# Altium schematic sheet Leds Switches.SchDoc: Bluebell Pod
size C; Author: DM; CompanyName: Silver Bullet Technology LLC; DrawnBy: D.McIntire; Engineer: DM; Organization: Silver Bullet Technology; Address1: Schematic; Address2: 5300 Via Andrea; Address3: Newbury Park, CA 91320; Address4: USA; DocumentNumber: BLUEBELL-POD; SheetNumber: 5; SheetTotal: 11
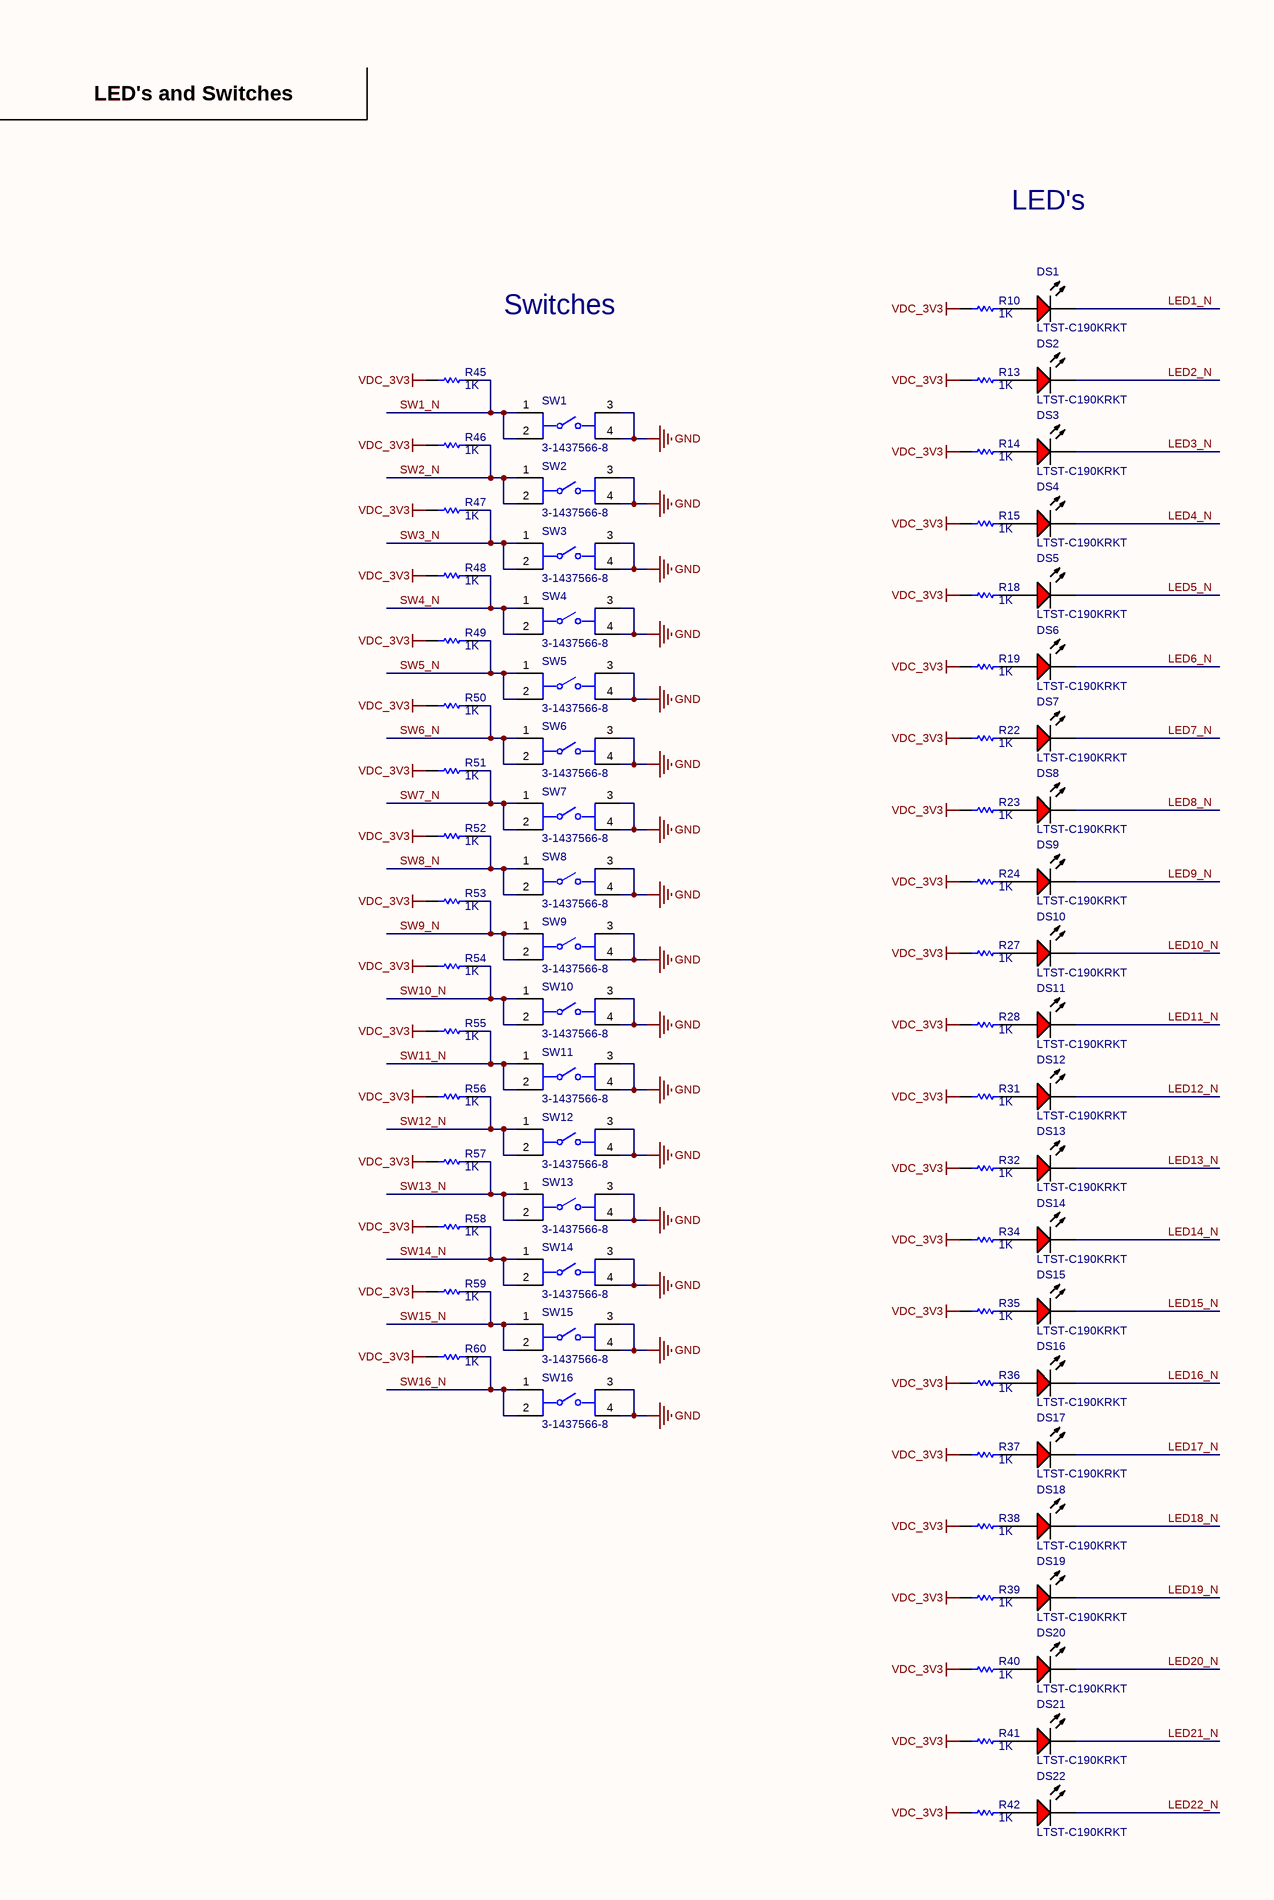
[diagram p0: Leds Switches.SchDoc, left]
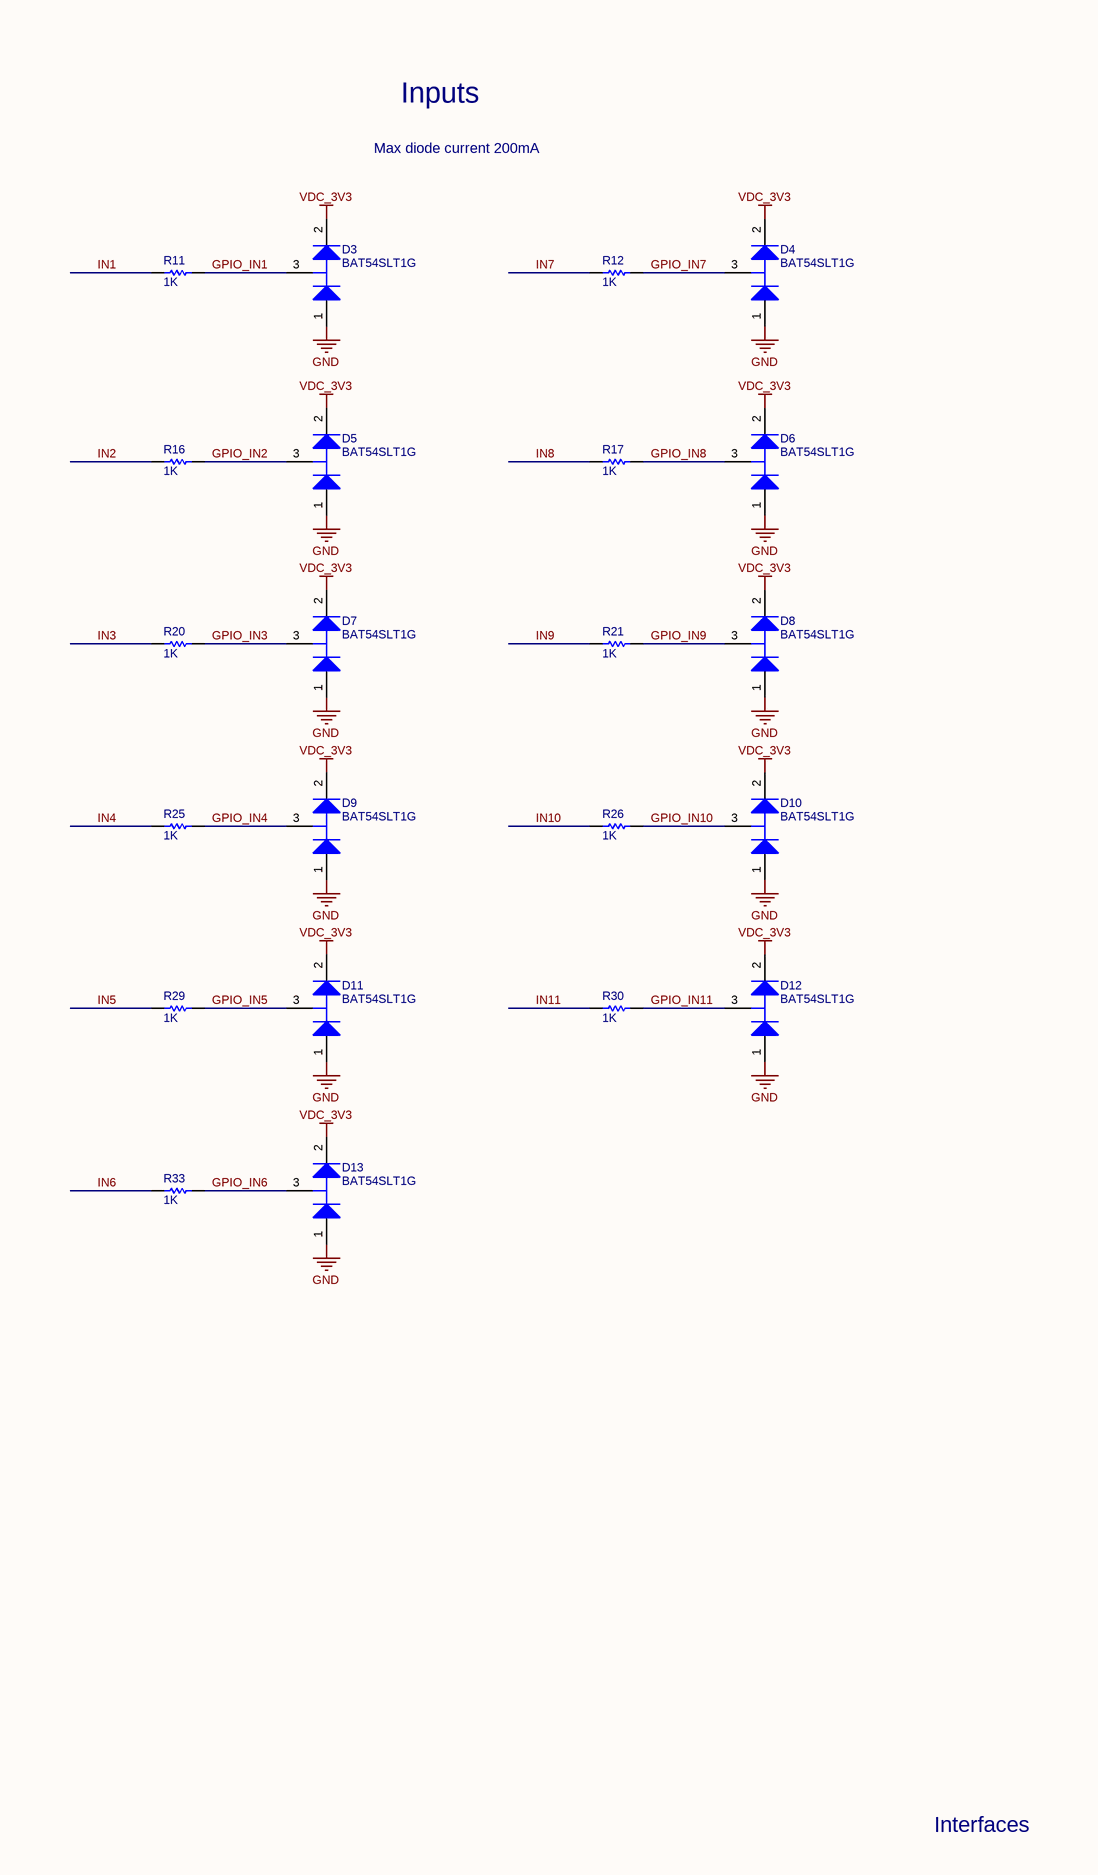
[diagram p1: Leds Switches.SchDoc, right]

## Parts
D3  BAT54SLT1G  [ONSC-SOT-23-3-318-08_V]
D4  BAT54SLT1G  [ONSC-SOT-23-3-318-08_V]
D5  BAT54SLT1G  [ONSC-SOT-23-3-318-08_V]
D6  BAT54SLT1G  [ONSC-SOT-23-3-318-08_V]
D7  BAT54SLT1G  [ONSC-SOT-23-3-318-08_V]
D8  BAT54SLT1G  [ONSC-SOT-23-3-318-08_V]
D9  BAT54SLT1G  [ONSC-SOT-23-3-318-08_V]
D10  BAT54SLT1G  [ONSC-SOT-23-3-318-08_V]
D11  BAT54SLT1G  [ONSC-SOT-23-3-318-08_V]
D12  BAT54SLT1G  [ONSC-SOT-23-3-318-08_V]
D13  BAT54SLT1G  [ONSC-SOT-23-3-318-08_V]
DS1  LTST-C190KRKT  [LTST-C191KRKT_V]
DS2  LTST-C190KRKT  [LTST-C191KRKT_V]
DS3  LTST-C190KRKT  [LTST-C191KRKT_V]
DS4  LTST-C190KRKT  [LTST-C191KRKT_V]
DS5  LTST-C190KRKT  [LTST-C191KRKT_V]
DS6  LTST-C190KRKT  [LTST-C191KRKT_V]
DS7  LTST-C190KRKT  [LTST-C191KRKT_V]
DS8  LTST-C190KRKT  [LTST-C191KRKT_V]
DS9  LTST-C190KRKT  [LTST-C191KRKT_V]
DS10  LTST-C190KRKT  [LTST-C191KRKT_V]
DS11  LTST-C190KRKT  [LTST-C191KRKT_V]
DS12  LTST-C190KRKT  [LTST-C191KRKT_V]
DS13  LTST-C190KRKT  [LTST-C191KRKT_V]
DS14  LTST-C190KRKT  [LTST-C191KRKT_V]
DS15  LTST-C190KRKT  [LTST-C191KRKT_V]
DS16  LTST-C190KRKT  [LTST-C191KRKT_V]
DS17  LTST-C190KRKT  [LTST-C191KRKT_V]
DS18  LTST-C190KRKT  [LTST-C191KRKT_V]
DS19  LTST-C190KRKT  [LTST-C191KRKT_V]
DS20  LTST-C190KRKT  [LTST-C191KRKT_V]
DS21  LTST-C190KRKT  [LTST-C191KRKT_V]
DS22  LTST-C190KRKT  [LTST-C191KRKT_V]
R10  value 1K  [RESC1608X55X30ML15T15]  (hidden comment: ERJ-3GEYJ102V)
R11  value 1K  [RESC1608X55X30ML15T15]  (hidden comment: ERJ-3GEYJ102V)
R12  value 1K  [RESC1608X55X30ML15T15]  (hidden comment: ERJ-3GEYJ102V)
R13  value 1K  [RESC1608X55X30ML15T15]  (hidden comment: ERJ-3GEYJ102V)
R14  value 1K  [RESC1608X55X30ML15T15]  (hidden comment: ERJ-3GEYJ102V)
R15  value 1K  [RESC1608X55X30ML15T15]  (hidden comment: ERJ-3GEYJ102V)
R16  value 1K  [RESC1608X55X30ML15T15]  (hidden comment: ERJ-3GEYJ102V)
R17  value 1K  [RESC1608X55X30ML15T15]  (hidden comment: ERJ-3GEYJ102V)
R18  value 1K  [RESC1608X55X30ML15T15]  (hidden comment: ERJ-3GEYJ102V)
R19  value 1K  [RESC1608X55X30ML15T15]  (hidden comment: ERJ-3GEYJ102V)
R20  value 1K  [RESC1608X55X30ML15T15]  (hidden comment: ERJ-3GEYJ102V)
R21  value 1K  [RESC1608X55X30ML15T15]  (hidden comment: ERJ-3GEYJ102V)
R22  value 1K  [RESC1608X55X30ML15T15]  (hidden comment: ERJ-3GEYJ102V)
R23  value 1K  [RESC1608X55X30ML15T15]  (hidden comment: ERJ-3GEYJ102V)
R24  value 1K  [RESC1608X55X30ML15T15]  (hidden comment: ERJ-3GEYJ102V)
R25  value 1K  [RESC1608X55X30ML15T15]  (hidden comment: ERJ-3GEYJ102V)
R26  value 1K  [RESC1608X55X30ML15T15]  (hidden comment: ERJ-3GEYJ102V)
R27  value 1K  [RESC1608X55X30ML15T15]  (hidden comment: ERJ-3GEYJ102V)
R28  value 1K  [RESC1608X55X30ML15T15]  (hidden comment: ERJ-3GEYJ102V)
R29  value 1K  [RESC1608X55X30ML15T15]  (hidden comment: ERJ-3GEYJ102V)
R30  value 1K  [RESC1608X55X30ML15T15]  (hidden comment: ERJ-3GEYJ102V)
R31  value 1K  [RESC1608X55X30ML15T15]  (hidden comment: ERJ-3GEYJ102V)
R32  value 1K  [RESC1608X55X30ML15T15]  (hidden comment: ERJ-3GEYJ102V)
R33  value 1K  [RESC1608X55X30ML15T15]  (hidden comment: ERJ-3GEYJ102V)
R34  value 1K  [RESC1608X55X30ML15T15]  (hidden comment: ERJ-3GEYJ102V)
R35  value 1K  [RESC1608X55X30ML15T15]  (hidden comment: ERJ-3GEYJ102V)
R36  value 1K  [RESC1608X55X30ML15T15]  (hidden comment: ERJ-3GEYJ102V)
R37  value 1K  [RESC1608X55X30ML15T15]  (hidden comment: ERJ-3GEYJ102V)
R38  value 1K  [RESC1608X55X30ML15T15]  (hidden comment: ERJ-3GEYJ102V)
R39  value 1K  [RESC1608X55X30ML15T15]  (hidden comment: ERJ-3GEYJ102V)
R40  value 1K  [RESC1608X55X30ML15T15]  (hidden comment: ERJ-3GEYJ102V)
R41  value 1K  [RESC1608X55X30ML15T15]  (hidden comment: ERJ-3GEYJ102V)
R42  value 1K  [RESC1608X55X30ML15T15]  (hidden comment: ERJ-3GEYJ102V)
R45  value 1K  [RESC1608X55X30ML15T15]  (hidden comment: ERJ-3GEYJ102V)
R46  value 1K  [RESC1608X55X30ML15T15]  (hidden comment: ERJ-3GEYJ102V)
R47  value 1K  [RESC1608X55X30ML15T15]  (hidden comment: ERJ-3GEYJ102V)
R48  value 1K  [RESC1608X55X30ML15T15]  (hidden comment: ERJ-3GEYJ102V)
R49  value 1K  [RESC1608X55X30ML15T15]  (hidden comment: ERJ-3GEYJ102V)
R50  value 1K  [RESC1608X55X30ML15T15]  (hidden comment: ERJ-3GEYJ102V)
R51  value 1K  [RESC1608X55X30ML15T15]  (hidden comment: ERJ-3GEYJ102V)
R52  value 1K  [RESC1608X55X30ML15T15]  (hidden comment: ERJ-3GEYJ102V)
R53  value 1K  [RESC1608X55X30ML15T15]  (hidden comment: ERJ-3GEYJ102V)
R54  value 1K  [RESC1608X55X30ML15T15]  (hidden comment: ERJ-3GEYJ102V)
R55  value 1K  [RESC1608X55X30ML15T15]  (hidden comment: ERJ-3GEYJ102V)
R56  value 1K  [RESC1608X55X30ML15T15]  (hidden comment: ERJ-3GEYJ102V)
R57  value 1K  [RESC1608X55X30ML15T15]  (hidden comment: ERJ-3GEYJ102V)
R58  value 1K  [RESC1608X55X30ML15T15]  (hidden comment: ERJ-3GEYJ102V)
R59  value 1K  [RESC1608X55X30ML15T15]  (hidden comment: ERJ-3GEYJ102V)
R60  value 1K  [RESC1608X55X30ML15T15]  (hidden comment: ERJ-3GEYJ102V)
SW1  Part Number: 3-1437566-8  [TECO-FSM6JSMA_V]  (hidden comment: Switch_TE_3-1437566-8_eec)
SW2  Part Number: 3-1437566-8  [TECO-FSM6JSMA_V]  (hidden comment: Switch_TE_3-1437566-8_eec)
SW3  Part Number: 3-1437566-8  [TECO-FSM6JSMA_V]  (hidden comment: Switch_TE_3-1437566-8_eec)
SW4  Part Number: 3-1437566-8  [TECO-FSM6JSMA_V]  (hidden comment: Switch_TE_3-1437566-8_eec)
SW5  Part Number: 3-1437566-8  [TECO-FSM6JSMA_V]  (hidden comment: Switch_TE_3-1437566-8_eec)
SW6  Part Number: 3-1437566-8  [TECO-FSM6JSMA_V]  (hidden comment: Switch_TE_3-1437566-8_eec)
SW7  Part Number: 3-1437566-8  [TECO-FSM6JSMA_V]  (hidden comment: Switch_TE_3-1437566-8_eec)
SW8  Part Number: 3-1437566-8  [TECO-FSM6JSMA_V]  (hidden comment: Switch_TE_3-1437566-8_eec)
SW9  Part Number: 3-1437566-8  [TECO-FSM6JSMA_V]  (hidden comment: Switch_TE_3-1437566-8_eec)
SW10  Part Number: 3-1437566-8  [TECO-FSM6JSMA_V]  (hidden comment: Switch_TE_3-1437566-8_eec)
SW11  Part Number: 3-1437566-8  [TECO-FSM6JSMA_V]  (hidden comment: Switch_TE_3-1437566-8_eec)
SW12  Part Number: 3-1437566-8  [TECO-FSM6JSMA_V]  (hidden comment: Switch_TE_3-1437566-8_eec)
SW13  Part Number: 3-1437566-8  [TECO-FSM6JSMA_V]  (hidden comment: Switch_TE_3-1437566-8_eec)
SW14  Part Number: 3-1437566-8  [TECO-FSM6JSMA_V]  (hidden comment: Switch_TE_3-1437566-8_eec)
SW15  Part Number: 3-1437566-8  [TECO-FSM6JSMA_V]  (hidden comment: Switch_TE_3-1437566-8_eec)
SW16  Part Number: 3-1437566-8  [TECO-FSM6JSMA_V]  (hidden comment: Switch_TE_3-1437566-8_eec)

## Nets
GND: D3.1(A) D4.1(A) D5.1(A) D6.1(A) D7.1(A) D8.1(A) D9.1(A) D10.1(A) D11.1(A) D12.1(A) D13.1(A) SW1.3 SW1.4 SW2.3 SW2.4 SW3.3 SW3.4 SW4.3 SW4.4 SW5.3 SW5.4 SW6.3 SW6.4 SW7.3 SW7.4 SW8.3 SW8.4 SW9.3 SW9.4 SW10.3 SW10.4 SW11.3 SW11.4 SW12.3 SW12.4 SW13.3 SW13.4 SW14.3 SW14.4 SW15.3 SW15.4 SW16.3 SW16.4
VDC_3V3: D3.2(K) D4.2(K) D5.2(K) D6.2(K) D7.2(K) D8.2(K) D9.2(K) D10.2(K) D11.2(K) D12.2(K) D13.2(K) R10.1 R13.1 R14.1 R15.1 R18.1 R19.1 R22.1 R23.1 R24.1 R27.1 R28.1 R31.1 R32.1 R34.1 R35.1 R36.1 R37.1 R38.1 R39.1 R40.1 R41.1 R42.1 R45.1 R46.1 R47.1 R48.1 R49.1 R50.1 R51.1 R52.1 R53.1 R54.1 R55.1 R56.1 R57.1 R58.1 R59.1 R60.1
GPIO_IN1: D3.3(K/A) R11.1
GPIO_IN2: D5.3(K/A) R16.1
GPIO_IN3: D7.3(K/A) R20.1
GPIO_IN4: D9.3(K/A) R25.1
GPIO_IN5: D11.3(K/A) R29.1
GPIO_IN6: D13.3(K/A) R33.1
GPIO_IN7: D4.3(K/A) R12.1
GPIO_IN8: D6.3(K/A) R17.1
GPIO_IN9: D8.3(K/A) R21.1
GPIO_IN10: D10.3(K/A) R26.1
GPIO_IN11: D12.3(K/A) R30.1
IN1: R11.2
IN2: R16.2
IN3: R20.2
IN4: R25.2
IN5: R29.2
IN6: R33.2
IN7: R12.2
IN8: R17.2
IN9: R21.2
IN10: R26.2
IN11: R30.2
LED1_N: DS1.2(K)
LED2_N: DS2.2(K)
LED3_N: DS3.2(K)
LED4_N: DS4.2(K)
LED5_N: DS5.2(K)
LED6_N: DS6.2(K)
LED7_N: DS7.2(K)
LED8_N: DS8.2(K)
LED9_N: DS9.2(K)
LED10_N: DS10.2(K)
LED11_N: DS11.2(K)
LED12_N: DS12.2(K)
LED13_N: DS13.2(K)
LED14_N: DS14.2(K)
LED15_N: DS15.2(K)
LED16_N: DS16.2(K)
LED17_N: DS17.2(K)
LED18_N: DS18.2(K)
LED19_N: DS19.2(K)
LED20_N: DS20.2(K)
LED21_N: DS21.2(K)
LED22_N: DS22.2(K)
SW1_N: R45.2 SW1.1 SW1.2
SW2_N: R46.2 SW2.1 SW2.2
SW3_N: R47.2 SW3.1 SW3.2
SW4_N: R48.2 SW4.1 SW4.2
SW5_N: R49.2 SW5.1 SW5.2
SW6_N: R50.2 SW6.1 SW6.2
SW7_N: R51.2 SW7.1 SW7.2
SW8_N: R52.2 SW8.1 SW8.2
SW9_N: R53.2 SW9.1 SW9.2
SW10_N: R54.2 SW10.1 SW10.2
SW11_N: R55.2 SW11.1 SW11.2
SW12_N: R56.2 SW12.1 SW12.2
SW13_N: R57.2 SW13.1 SW13.2
SW14_N: R58.2 SW14.1 SW14.2
SW15_N: R59.2 SW15.1 SW15.2
SW16_N: R60.2 SW16.1 SW16.2
NetDS1_1: DS1.1(A) R10.2
NetDS2_1: DS2.1(A) R13.2
NetDS3_1: DS3.1(A) R14.2
NetDS4_1: DS4.1(A) R15.2
NetDS5_1: DS5.1(A) R18.2
NetDS6_1: DS6.1(A) R19.2
NetDS7_1: DS7.1(A) R22.2
NetDS8_1: DS8.1(A) R23.2
NetDS9_1: DS9.1(A) R24.2
NetDS10_1: DS10.1(A) R27.2
NetDS11_1: DS11.1(A) R28.2
NetDS12_1: DS12.1(A) R31.2
NetDS13_1: DS13.1(A) R32.2
NetDS14_1: DS14.1(A) R34.2
NetDS15_1: DS15.1(A) R35.2
NetDS16_1: DS16.1(A) R36.2
NetDS17_1: DS17.1(A) R37.2
NetDS18_1: DS18.1(A) R38.2
NetDS19_1: DS19.1(A) R39.2
NetDS20_1: DS20.1(A) R40.2
NetDS21_1: DS21.1(A) R41.2
NetDS22_1: DS22.1(A) R42.2

## Notes on the sheet
- LED's and Switches
- LED's
- Max diode current 200mA
- Inputs
- Switches
- Interfaces
- Silver Bullet Technology LLC
- SHEET
- PROJECT
- REV
- 5300 VIA ANDREA
- NEWBURY PARK, CA 91320
- PHONE: (310) 710-7998
- EMAIL: INFO@SILVER-BULLET-TECH.COM
- SIZE
- ENGR
- C
- MODIFIED
- DOCUMENT
- /
- This document contains confidential and proprietary information. No disclosure, reproduction, or transfer of this material in part or in its entirety shall be done without prior written approval.

## Library data of the parts
D3-D13 = CMP-1055-00536-1: Dual Series Schottky Barrier Diodes, 3-Pin SOT-23, Pb-Free, Tape and Reel; Manufacturer: On Semiconductor; IFSM Max (A): 0.6; trr Max (ns): 5; DatasheetVersion: Rev. 15; ComponentLink3Description: Package Specification; ComponentLink1URL: http://www.onsemi.com/; ComponentLink1Description: Manufacturer URL; PackageDescription: 3-Pin Small Outline Transistor, Body 2.92 x 1.3 mm, Pitch 0.95 mm; Configuration: Dual; ComponentLink2Description: Datasheet; RoHS: TRUE; ComponentLink3URL: http://www.onsemi.cn/pub_link/Collateral/318-08.PDF; PackageVersion: Rev. AP, 11/2009; Packing: Tape and Reel; PartNumber: BAT54SLT1G; PackageReference: SOT-23-3-318-08; ComponentLink2URL: http://www.onsemi.cn/pub_link/Collateral/BAT54SLT1-D.PDF; Mounting Technology: Surface Mount
DS1-DS22 = CMP-1674-00011-1: LED Uni-Color Red, 62.5 mW, 5 V, -30 to 85 degC, 2-Pin SMD, RoHS, Tape and Reel; Capacitance: 100 uF; Voltage Rating: 50 V; Case\Package: Radial; Tolerance: 20%; Packaging: Bulk; REACH SVHC: No SVHC; ComponentLink1Description: Manufacturer URL; ComponentLink2URL: http://optoelectronics.liteon.com/upload/download/DS-22-99-0151/S_110_LTST-C190KRKT.pdf; Max Operating Temperature: 85 degC; DatasheetVersion: Rev. F, 05/2013; Pins: 2; Voltage Rating (DC): 50 V; Mount: Through Hole; Lead Pitch: 3.5 mm; Diameter: 8 mm; ComponentLink1URL: http://www.us.liteon.com/; Radiation Hardening: No; Package Quantity: 200; PackageReference: C191KRKT; RoHSCompliant: true; Height: 11.5 mm; PackageDescription: 2-Pin Surface Mount Device, Body 1.6 x 0.8 mm; Length: 11.5 mm; ComponentLink2Description: Datasheet; Min Operating Temperature: -40 degC
R10-R42 R45-R60 = CMP-2000-00703-1: Manufacturer: Panasonic; Part Number: ERJ-3GEYJ102V
SW1-SW16 = Switch_TE_3-1437566-8_eec: SWITCH Tactile Switch SPST-NO Top Actuated Surface Mount; Manufacturer: TE; MIN CONTACT RATING: 10uA @ 1V DC; MAX CONTACT RATING: 50mA @ 25V DC; helpURL: https://upverter.com/upn/revision/888303415c12e25b/; ComponentLink2Description: Datasheet; Temperature: -35°C to +85°C; Package: SMT_6MM0_6MM0; Supplier 2: Mouser; Supplier 1: Digi-Key; ComponentLink1URL: https://upverter.com/upn/revision/888303415c12e25b/; Supplier Part Number 2: 506-3-1437566-8; Supplier Part Number 1: FSM8JSMA-ND; ComponentLink1Description: Upverter; ComponentLink2URL: http://www.te.com/commerce/DocumentDelivery/DDEController?Action=showdoc&DocId=Customer+Drawing%7F2-1437565-7%7FV%7Fpdf%7FEnglish%7FENG_CD_2-1437565-7_V.pdf%7F3-1437566-8; RoHS: TRUE; Mouser Part Number: 506-3-1437566-8; Temperature Range High: +85°C; Digikey Description: SWITCH Tactile Switch SPST-NO Top Actuated Surface Mount; Digikey Part Number: FSM8JSMA-ND; Lead Free: yes; Circuit: SPST-NO; Temperature Range Low: -35°C